# Altium project UZ_CarrierBoard.PrjPcb (part 7 of 10)

## Sheet Power_Supply_TPS54260.SchDoc
size A4; Author: AG / EA / MG; CompanyName: Technische Hochschule Nürnberg Georg Simon Ohm; Organization: UltraZohm; Address1: Kesslerplatz 12; Address2: 90489 Nürnberg; Address3: GERMANY; SheetNumber: 23; SheetTotal: 40; Website: www.ultrazohm.com
Used 4 times, as channels U_User_Connectors/12V_FAN, U_Power_Supply_2/1V8_PER, U_Power_Supply_2/1V8_MOD, U_S3C_SupplyAndMonitoring/3V3_S3C. Parts and nets are listed once, with the designators drawn on the sheet.
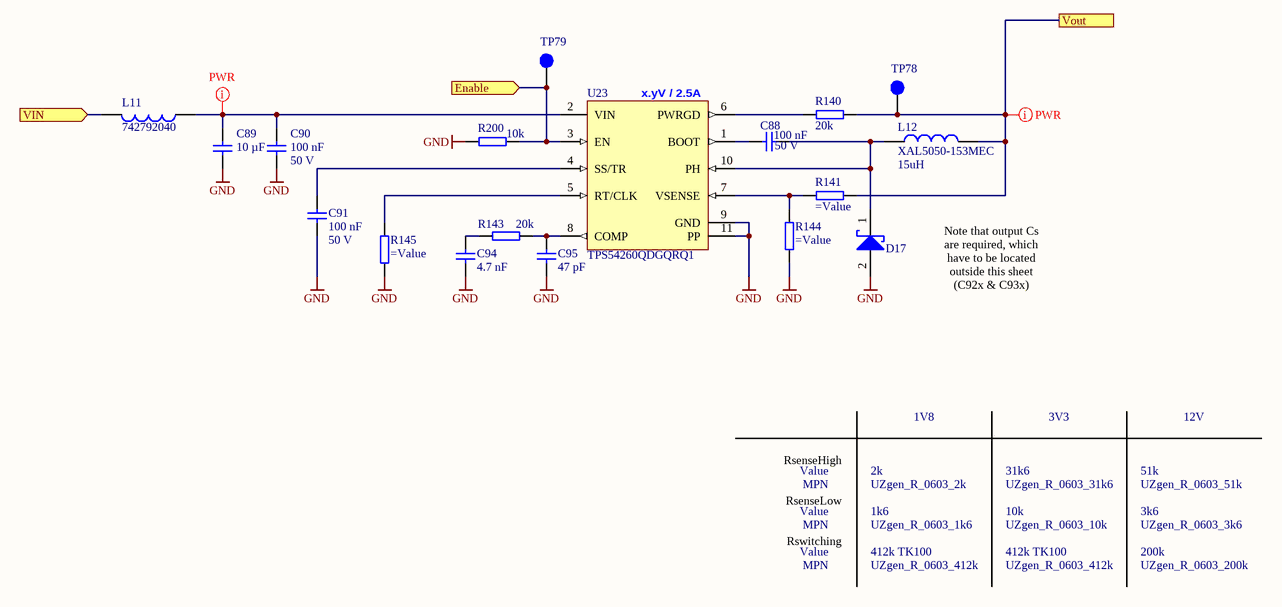
[diagram p23: Power_Supply_TPS54260.SchDoc]

### Parts
C88  100 nF  Voltage: 50 V  [C_0603_TE]
C89  10 µF  [C_1206_TE]
C90  100 nF  Voltage: 50 V  [C_0603_TE]
C91  100 nF  Voltage: 50 V  [C_0603_TE]
C94  4.7 nF  [C_0603_TE]
C95  47 pF  [C_0603_TE]
D17  STPS340UY  [SMB]  (value not drawn)
L11  742792040  [WE-CBF_0805_High Current]
L12  XAL5050-153MEC  value 15uH  [XAL5050153MEC]
R140  20k  [R_0603_TE]
R141  (no value)  [R_0603_TE]
R143  20k  [R_0603_TE]
R144  (no value)  [R_0603_TE]
R145  (no value)  [R_0603_TE]
R200  10k  [R_0603_TE]
TP78  Testpoint 1mm  [TP_1mm]  (value not drawn)  (no BOM)
TP79  Testpoint 1mm  [TP_1mm]  (value not drawn)  (no BOM)
U23  TPS54260QDGQRQ1  [TSOP-10_DGQ0010D_N]

### Ports
Enable (in), VIN (in), Vout

### Nets
GND: C89.2 C90.1 C91.1 C94.2 C95.2 D17.2(A) R144.2 R145.2 R200.1 U23.9(GND) U23.11(PP)
Enable: R200.2 TP79.1 U23.3(EN) ; port Enable
VIN: L11.2 ; port VIN
Vout: L12.2 R140.1 R141.1 TP78.1 ; port Vout
NetC88_1: C88.1 D17.1(K) L12.1 U23.10(PH)
NetC88_2: C88.2 U23.1(BOOT)
NetC89_1: C89.1 C90.2 L11.1 U23.2(VIN)
NetC91_2: C91.2 U23.4(SS/TR)
NetC94_1: C94.1 R143.2
NetC95_1: C95.1 R143.1 U23.8(COMP)
NetR140_2: R140.2 U23.6(PWRGD)
NetR141_2: R141.2 R144.1 U23.7(VSENSE)
NetR145_1: R145.1 U23.5(RT/CLK)

### Channels
U_User_Connectors/12V_FAN: designators end in A; ports Enable=Enable VIN=VIN Vout=12V_FAN
U_Power_Supply_2/1V8_PER: designators end in B; ports Enable=Enable VIN=VIN Vout=1V8out_PER
U_Power_Supply_2/1V8_MOD: designators end in C; ports Enable=Enable VIN=VIN Vout=1V8out_MOD
U_S3C_SupplyAndMonitoring/3V3_S3C: designators end in D; ports Enable=Enable VIN=VIN4 Vout=3V3_S3C

### Layout directives
net class PWR: 12V_FAN, NetC89A_1

### Notes on the sheet
- (near U23) x.yV / 2.5A
- Note that output Cs are required, which have to be located outside this sheet (C92x & C93x)
- RsenseHigh (@{"Id":"WRUMMABL\CGJYPHNX","ObjectType":2})
- 1V8
- 3V3
- 12V
- RsenseLow (@{"Id":"WRUMMABL\LDWXELDL","ObjectType":2})
- Value
- MPN
- 2k
- UZgen_R_0603_2k
- 1k6
- UZgen_R_0603_1k6
- 31k6
- UZgen_R_0603_31k6
- 10k
- UZgen_R_0603_10k
- 51k
- 3k6
- UZgen_R_0603_3k6
- UZgen_R_0603_51k
- Rswitching (@{"Id":"WRUMMABL\GZIHHFRB","ObjectType":2})
- 412k TK100
- UZgen_R_0603_412k
- 200k
- UZgen_R_0603_200k
- Title
- Revision:
- Design Engineer:
- Date:
- Project:
- Sheet
- of

### Library data of the parts
C88 C90 C91 = UZgen_C_0603_100nF_50V_X7R: Generic capacitor; Manufacturer: UZgen; Tolerance: 10 %; Created from: AGeiger; Value: 100 nF; Technology: X7R; Manufacturer Part Number: UZgen_C_0603_100nF_50V_X7R; PartID: 1; Created On: 02/07/2024 14:42:23; Device Package: 0603; Mounting Type: SMD; Last Updated: 02/08/2024 14:45:57
C89 = CL31B106KBHNNNE: 50V 10uF X7R ±10% 1206  Multilayer Ceramic Capacitors MLCC - SMD/SMT ROHS; Manufacturer: Samsung Electro-Mechanics; Voltage Rating: 50 VDC; Created from: AGeiger; Value: 10 µF; Tolerance: 10 %; Manufacturer Part Number: CL31B106KBHNNNE; PartID: 107; Created On: 20/09/2022 20:14:50; ComponentLink1Description: Datasheet; ComponentLink1URL: https://datasheet.lcsc.com/lcsc/1810221111_Samsung-Electro-Mechanics-CL31B106KBHNNNE_C89632.pdf; Component Type: Capacitor 1206; Device Package: 1206; Last Updated: 02/08/2024 15:35:49; Mounting Type: SMD; Operating Temperature: -55 - 125°C; Series: X7R; Supplier 1: LCSC; Supplier Part Number 1: C89632; Type: Capacitor; Live Cycle Status: 1; LCSC Part Number: C89632
C94 = GRM1885C1H472JA01D: 50V 4.7nF C0G ±5% 0603 Multilayer Ceramic Capacitors MLCC; Manufacturer: Murata Electronics; Created from: MGeier; Tolerance: 5%; Value: 4.7 nF; Manufacturer Part Number: GRM1885C1H472JA01D; PartID: 153; Created On: 02/08/2024 16:00:00; ComponentLink1Description: Datasheet; ComponentLink1URL: https://wmsc.lcsc.com/wmsc/upload/file/pdf/v2/lcsc/2304140030_Murata-Electronics-GRM1885C1H472JA01D_C85980.pdf; Component Type: Capacitor 0603; Device Package: 0603; Last Updated: 02/08/2024 16:00:00; Mounting Type: SMD; Operating Temperature: –55 to 125°C; Series: GRM (Chip Multilayer Ceramic Capacitors for General Purpose); Supplier 1: LCSC; Supplier Part Number 1: C85980; Type: Capacitor; Voltage Rating: 50 V; Live Cycle Status: 1; LCSC Part Number: C85980; Stock number: not stored
C95 = CL10C470JB8NNNC: 50V 47pF C0G ±5% 0603 Multilayer Ceramic Capacitors MLCC; Manufacturer: Samsung Electro-Mechanics; Created from: MGeier; Tolerance: 5%; Value: 47 pF; Manufacturer Part Number: CL10C470JB8NNNC; PartID: 154; Created On: 02/08/2024 16:00:00; ComponentLink1Description: Datasheet; ComponentLink1URL: https://wmsc.lcsc.com/wmsc/upload/file/pdf/v2/lcsc/2304140030_Samsung-Electro-Mechanics-CL10C470JB8NNNC_C1671.pdf; Component Type: Capacitor 0603; Device Package: 0603; Last Updated: 02/08/2024 16:00:00; Mounting Type: SMD; Operating Temperature: –55 to 125°C; Series: CL; Supplier 1: LCSC; Supplier Part Number 1: C1671; Type: Capacitor; Voltage Rating: 50 V; Live Cycle Status: 1; LCSC Part Number: C1671; Stock number: not stored
D17 = STPS340UY: Power Schottky Rectifier, 3 A, 40 V, 0.57 µF; Manufacturer: STMicroelectronics; Forward Current: 3 A; Forward Voltage: 0.84 V; Reverse Current: 10 mA; Created from: MGremer; Manufacturer Part Number: STPS340UY; PartID: 1; Created On: 06/01/2021 14:34:10; ComponentLink1Description: Datasheet; ComponentLink1URL: https://www.mouser.de/datasheet/2/389/stps340_y-1851750.pdf; Component Type: Power Schottky Rectifier; Device Package: SMB; Last Updated: 04/09/2024 15:38:15; Mounting Type: SMD; Operating Temperature: -40 to +150 °C; Series: STPS340-Y; Supplier 1: Mouser; Supplier Part Number 1: 511-STPS340UY; Type: Power Schottky Rectifier; Value: -; Live Cycle Status: 1; Stock number: not stored; Supplier 2: LCSC; Supplier Part Number 2: C283520; LCSC Part Number: C283520
L11 = 742792040: Inductance, 0805, 100 MHz, 600 Ohm, 2 A; Manufacturer: Wuerth Elektronik; Type: Inductance SMD; DC current: 2 A; Value: 600 Ohm; Created from: AGeiger; Manufacturer Part Number: 742792040; PartID: 1; Created On: 18/01/2021 14:53:17; ComponentLink1Description: Datasheet; ComponentLink1URL: https://www.mouser.de/datasheet/2/445/742792040-1720361.pdf; Component Type: Inductance; Device Package: 0805; Last Updated: 22/08/2024 07:43:45; Mounting Type: SMD; Operating Temperature: -55 - 125 °C; Series: WE-CBF; Supplier 1: Mouser; Supplier Part Number 1: 710-742792040; Live Cycle Status: 1; LCSC Part Number: C2661857; Stock number: not stored
L12 = XAL5050-153MEC: 15uH@1MHz  ±20%, 3.9A, 76.7mOhm; Manufacturer: Coilcraft; MF: EPCOS / TDK; DCR: 320m; Rated Current: 0.85 A; Type: Inductance SMD; Created from: FRosner; MPN: B82464G4154M; Supplier 1: Mouser; Supplier Part Number 1: 994-XAL5050-153MEC; Manufacturer Part Number: XAL5050-153MEC; PartID: 24; Created On: 05/09/2024 12:44:32; ComponentLink1Description: Datasheet; ComponentLink1URL: https://www.mouser.de/datasheet/2/597/xal50xx-270657.pdf; Component Type: SMD Power Inductor; Device Package: 5.28 x5.1x5.48mm; Last Updated: 05/09/2024 12:44:32; Mounting Type: SMD; Operating Temperature: -40°C to +125°C; Series: XAL5050; Supplier 2: LCSC; Supplier Part Number 2: C5291298; DC current: 3.9 A; Live Cycle Status: 1; LCSC Part Number: C5291298; Stock number: not stored
R140 R143 = UZgen_R_0603_20k: Generic resistor; Manufacturer: UZgen; Tolerance: 1 %; Created from: UZgenTool; Value: 20k; Manufacturer Part Number: UZgen_R_0603_20k; PartID: 251; Created On: 02.07.2024 17:29:50; Device Package: 0603; Mounting Type: SMD; Last Updated: 02.07.2024 17:29:50
R141 R144 R145 = UZgen_R_0603_ParaR: Generic resistor (parametric); Manufacturer: UZgen; Tolerance: 1 %; Created from: UZgenTool; PartID: 588; Created On: 08/07/2024 14:34:30; Device Package: 0603; Mounting Type: SMD; Last Updated: 08/07/2024 14:34:30
  R141: Value: =RsenseHigh_Value; Manufacturer Part Number: =RsenseHigh_MPN
  R144: Value: =RsenseLow_Value; Manufacturer Part Number: =RsenseLow_MPN
  R145: Manufacturer Part Number: =Rswitching_MPN; Value: =Rswitching_Value
R200 = UZgen_R_0603_10k: Generic resistor; Manufacturer: UZgen; Tolerance: 1 %; Created from: AGeiger; Value: 10k; Manufacturer Part Number: UZgen_R_0603_10k; PartID: 1; Created On: 02.07.2024 14:34:53; Device Package: 0603; Mounting Type: SMD; Last Updated: 02.07.2024 14:37:16
TP78 TP79 = NULL: Manufacturer Part Number: NULL; Created from: AGeiger; Created: 2018_06_25_AGeiger; Value: Testpoint 1mm; PartID: 9; Created On: 20/09/2022 13:14:57; Component Type: Testpoint; Last Updated: 20/09/2022 13:15:39; Manufacturer: NULL; Supplier 1: NULL; Supplier Part Number 1: NULL; Type: Testpoint; Live Cycle Status: 1
U23 = TPS54260QDGQRQ1: High Efficiency Step-Down Converter, MSOP Package, 2.5 A, 3.5 - 60 V input, adjustable output; Manufacturer: Texas Instruments; Created from: MGremer; Value: 2.5 A; Manufacturer Part Number: TPS54260QDGQRQ1; PartID: 4; Created On: 06/01/2021 09:48:37; ComponentLink1Description: Datasheet; ComponentLink1URL: https://www.ti.com/general/docs/suppproductinfo.tsp?distId=26&gotoUrl=http%3A%2F%2Fwww.ti.com%2Flit%2Fgpn%2Ftps54260-q1; Component Type: Step-Down Converter; Last Updated: 12/09/2024 22:45:16; Mounting Type: SMD; Supplier 1: Mouser; Supplier Part Number 1: 595-TPS54260QDGQRQ1; Type: Step-Down Converter; Live Cycle Status: 1; LCSC Part Number: C181278; Stock number: not stored; Device Package: MSOP; Series: TPS54260-Q1

## Sheet Power_Supply_1.SchDoc
size A4; Author: AG / EA / MG; CompanyName: Technische Hochschule Nürnberg Georg Simon Ohm; Organization: UltraZohm; Address1: Kesslerplatz 12; Address2: 90489 Nürnberg; Address3: GERMANY; SheetNumber: 27; Website: www.ultrazohm.com
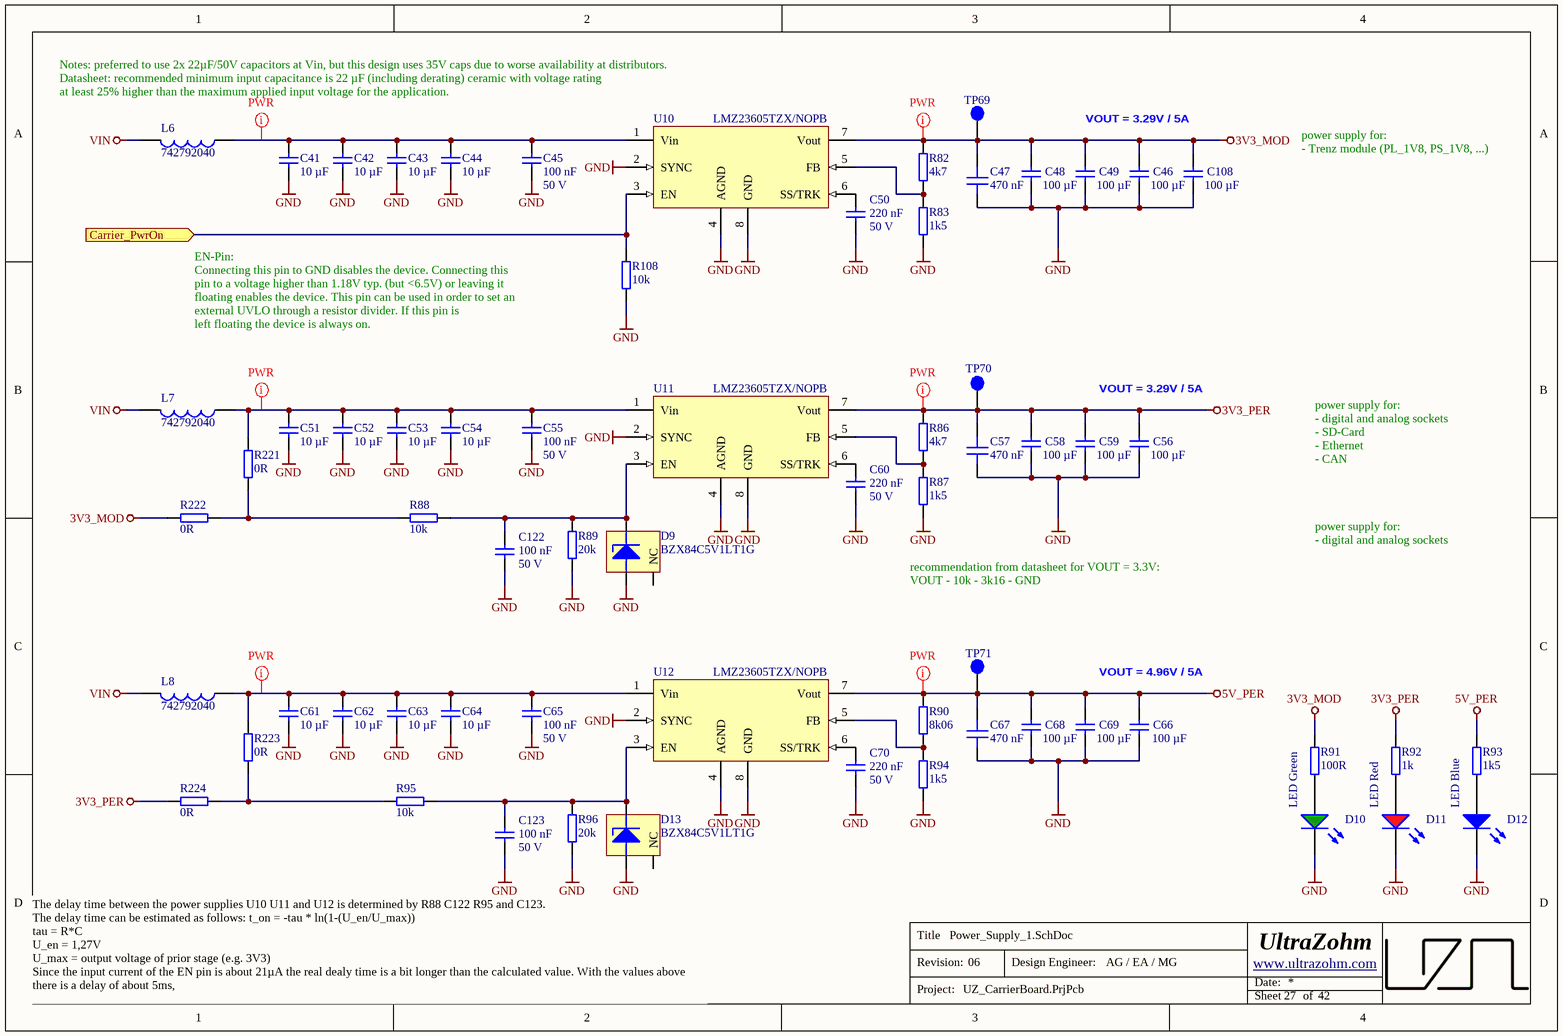
[diagram p24: Power_Supply_1.SchDoc]

### Parts
C41  10 µF  [C_1206_TE]
C42  10 µF  [C_1206_TE]
C43  10 µF  [C_1206_TE]
C44  10 µF  [C_1206_TE]
C45  100 nF  Voltage: 50 V  [C_0603_TE]
C46  100 µF  [C_1206_TE]
C47  470 nF  [C_0603_TE]
C48  100 µF  [C_1206_TE]
C49  100 µF  [C_1206_TE]
C50  220 nF  Voltage: 50 V  [C_0603_TE]
C51  10 µF  [C_1206_TE]
C52  10 µF  [C_1206_TE]
C53  10 µF  [C_1206_TE]
C54  10 µF  [C_1206_TE]
C55  100 nF  Voltage: 50 V  [C_0603_TE]
C56  100 µF  [C_1206_TE]
C57  470 nF  [C_0603_TE]
C58  100 µF  [C_1206_TE]
C59  100 µF  [C_1206_TE]
C60  220 nF  Voltage: 50 V  [C_0603_TE]
C61  10 µF  [C_1206_TE]
C62  10 µF  [C_1206_TE]
C63  10 µF  [C_1206_TE]
C64  10 µF  [C_1206_TE]
C65  100 nF  Voltage: 50 V  [C_0603_TE]
C66  100 µF  [C_1206_TE]
C67  470 nF  [C_0603_TE]
C68  100 µF  [C_1206_TE]
C69  100 µF  [C_1206_TE]
C70  220 nF  Voltage: 50 V  [C_0603_TE]
C108  100 µF  [C_1206_TE]
C122  100 nF  Voltage: 50 V  [C_0603_TE]
C123  100 nF  Voltage: 50 V  [C_0603_TE]
D9  BZX84C5V1LT1G  [SOT95P237X112-3N]
D10  LED Green  [WL-SMCW_0603]
D11  LED Red  [WL-SMCW_0603]
D12  LED Blue  [WL-SMCW_0603]
D13  BZX84C5V1LT1G  [SOT95P237X112-3N]
L6  742792040  [WE-CBF_0805_High Current]
L7  742792040  [WE-CBF_0805_High Current]
L8  742792040  [WE-CBF_0805_High Current]
R82  4k7  [R_0603_TE]
R83  1k5  [R_0603_TE]
R86  4k7  [R_0603_TE]
R87  1k5  [R_0603_TE]
R88  10k  [R_0603_TE]
R89  20k  [R_0603_TE]
R90  8k06  [R_0402_TE]
R91  100R  [R_0603_TE]
R92  1k  [R_0603_TE]
R93  1k5  [R_0603_TE]
R94  1k5  [R_0603_TE]
R95  10k  [R_0603_TE]
R96  20k  [R_0603_TE]
R108  10k  [R_0603_TE]
R221  0R  [R_1206_TE]
R222  0R  [R_1206_TE]
R223  0R  [R_1206_TE]
R224  0R  [R_1206_TE]
TP69  Testpoint 1mm  [TP_1mm]  (value not drawn)  (no BOM)
TP70  Testpoint 1mm  [TP_1mm]  (value not drawn)  (no BOM)
TP71  Testpoint 1mm  [TP_1mm]  (value not drawn)  (no BOM)
U10  LMZ23605TZX/NOPB  [7TO-PMOD]
U11  LMZ23605TZX/NOPB  [7TO-PMOD]
U12  LMZ23605TZX/NOPB  [7TO-PMOD]

### Ports
Carrier_PwrOn (in)

### Nets
3V3_MOD: C46.1 C47.1 C48.1 C49.1 C108.1 R82.2 R91.2 R222.2 TP69.1 U10.7(Vout)
3V3_PER: C56.1 C57.1 C58.1 C59.1 R86.2 R92.2 R224.2 TP70.1 U11.7(Vout)
5V_PER: C66.1 C67.1 C68.1 C69.1 R90.1 R93.2 TP71.1 U12.7(Vout)
GND: C41.2 C42.2 C43.2 C44.2 C45.1 C46.2 C47.2 C48.2 C49.2 C50.2 C51.2 C52.2 C53.2 C54.2 C55.1 C56.2 C57.2 C58.2 C59.2 C60.2 C61.2 C62.2 C63.2 C64.2 C65.1 C66.2 C67.2 C68.2 C69.2 C70.2 C108.2 C122.2 C123.2 D9.1(ANODE) D10.1(K) D11.1(K) D12.1(K) D13.1(ANODE) R83.1 R87.1 R89.1 R94.2 R96.1 R108.1 U10.2(SYNC) U10.4(AGND) U10.8(GND) U11.2(SYNC) U11.4(AGND) U11.8(GND) U12.2(SYNC) U12.4(AGND) U12.8(GND)
VIN: L6.2 L7.2 L8.2
Carrier_PwrOn: R108.2 U10.3(EN) ; port Carrier_PwrOn
NetC41_1: C41.1 C42.1 C43.1 C44.1 C45.2 L6.1 U10.1(Vin)
NetC50_1: C50.1 U10.6(SS/TRK)
NetC51_1: C51.1 C52.1 C53.1 C54.1 C55.2 L7.1 R221.2 U11.1(Vin)
NetC60_1: C60.1 U11.6(SS/TRK)
NetC61_1: C61.1 C62.1 C63.1 C64.1 C65.2 L8.1 R223.2 U12.1(Vin)
NetC70_1: C70.1 U12.6(SS/TRK)
NetC122_1: C122.1 D9.3(KATHODE) R88.2 R89.2 U11.3(EN)
NetC123_1: C123.1 D13.3(KATHODE) R95.2 R96.2 U12.3(EN)
NetD10_2: D10.2(A) R91.1
NetD11_2: D11.2(A) R92.1
NetD12_2: D12.2(A) R93.1
NetR82_1: R82.1 R83.2 U10.5(FB)
NetR86_1: R86.1 R87.2 U11.5(FB)
NetR88_1: R88.1 R221.1 R222.1
NetR90_2: R90.2 R94.1 U12.5(FB)
NetR95_1: R95.1 R223.1 R224.1

Not connected (* = marked no-connect by the designer): D9 2(NC); D13 2(NC)

### Layout directives
net class PWR: 3V3_MOD, 3V3_PER, 5V_PER, NetC41_1, NetC51_1, NetC61_1

### Notes on the sheet
- Notes: preferred to use 2x 22µF/50V capacitors at Vin, but this design uses 35V caps due to worse availability at distributors.
- Datasheet: recommended minimum input capacitance is 22 µF (including derating) ceramic with voltage rating
- at least 25% higher than the maximum applied input voltage for the application.
- VOUT = 3.29V / 5A
- power supply for:
  - Trenz module (PL_1V8, PS_1V8, ...)
- EN-Pin:
  Connecting this pin to GND disables the device. Connecting this pin to a voltage higher than 1.18V typ. (but <6.5V) or leaving it floating enables the device. This pin can be used in order to set an external UVLO through a resistor divider. If this pin is
  left floating the device is always on.
- power supply for:
  - digital and analog sockets
  - SD-Card
  - Ethernet
  - CAN
- power supply for:
  - digital and analog sockets
- recommendation from datasheet for VOUT = 3.3V:
  VOUT - 10k - 3k16 - GND
- VOUT = 4.96V / 5A
- The delay time between the power supplies U10 U11 and U12 is determined by R88 C122 R95 and C123.
  The delay time can be estimated as follows: t_on = -tau * ln(1-(U_en/U_max))
  tau = R*C
  U_en = 1,27V
  U_max = output voltage of prior stage (e.g. 3V3)
  Since the input current of the EN pin is about 21µA the real dealy time is a bit longer than the calculated value. With the values above there is a delay of about 5ms,
- Title
- Revision:
- Design Engineer:
- Date:
- Project:
- Sheet
- of

### Library data of the parts
C41-C44 C51-C54 C61-C64 = UZgen_C_1206_10uF_50V_X7R: Generic capacitor; Manufacturer: UZgen; Tolerance: 10 %; Created from: MGeier; Voltage: 50V; Value: 10 µF; Manufacturer Part Number: UZgen_C_1206_10uF_50V_X7R; PartID: 5807; Created On: 20/03/2025 14:05:00; Device Package: 1206; Last Updated: 20/03/2025 14:05:00; Mounting Type: SMD; Technology: X7R
C45 C55 C65 C122 C123 = UZgen_C_0603_100nF_50V_X7R: as C88 on sheet Power_Supply_TPS54260; Value: 100 nF; Technology: X7R; Manufacturer Part Number: UZgen_C_0603_100nF_50V_X7R; PartID: 1; Created On: 02/07/2024 14:42:23; Device Package: 0603; Mounting Type: SMD; Last Updated: 02/08/2024 14:45:57
C46 C48 C49 C56 C58 C59 C66 C68 C69 C108 = CL31A107MQHNNNE: 6.3V 100uF X5R ±20% 1206 Multilayer Ceramic Capacitors MLCC; Manufacturer: Samsung Electro-Mechanics; Created from: MGeier; Tolerance: 20%; Value: 100 µF; Manufacturer Part Number: CL31A107MQHNNNE; PartID: 152; Created On: 02/08/2024 16:00:00; ComponentLink1Description: Datasheet; ComponentLink1URL: https://wmsc.lcsc.com/wmsc/upload/file/pdf/v2/lcsc/2304140030_Samsung-Electro-Mechanics-CL31A107MQHNNNE_C15008.pdf; Component Type: Capacitor 1206; Device Package: 1206; Last Updated: 02/08/2024 16:00:00; Mounting Type: SMD; Operating Temperature: -55 - 85°C; Series: CL; Supplier 1: LCSC; Supplier Part Number 1: C15008; Type: Capacitor; Voltage Rating: 6.3 V; Live Cycle Status: 1; LCSC Part Number: C15008; Stock number: not stored
C47 C57 C67 = CL10A474KB8NNNC: Capacitor 0603, 50 VDC, 470 nF, X5R; Manufacturer: Samsung Electro-Mechanics; Tolerance: 10 %; Created from: AGeiger; Voltage Rating: 50 VDC; Value: 470 nF; Manufacturer Part Number: CL10A474KB8NNNC; PartID: 103; Created On: 22/08/2022 14:44:45; Device Package: 0603; Mounting Type: SMD; Last Updated: 22/04/2025 15:48:45; ComponentLink1Description: Datasheet; ComponentLink1URL: https://datasheet.lcsc.com/lcsc/1810191213_Samsung-Electro-Mechanics-CL10A474KB8NNNC_C170149.pdf; Component Type: Capacitor 0603; Operating Temperature: -55 - 85°C; Series: X5R; Supplier 1: LCSC; Supplier Part Number 1: C170149; Supplier 2: Mouser; Supplier Part Number 2: 187-CL10A474KB8NNNC; Type: Capacitor; Live Cycle Status: 1; LCSC Part Number: C170149
C50 C60 C70 = UZgen_C_0603_220nF_50V_X7R: Generic capacitor; Manufacturer: UZgen; Tolerance: 10 %; Created from: UZgenTool; Value: 220 nF; Technology: X7R; Manufacturer Part Number: UZgen_C_0603_220nF_50V_X7R; PartID: 2; Created On: 02/07/2024 14:42:23; Device Package: 0603; Mounting Type: SMD; Last Updated: 02/08/2024 14:45:57
D9 D13 = 30827: Zener Diode 5.1V 6% 225mW; AN: 30827; Mixed: SMT; Temperature-Range: -65/+150 (Tj Abs); Case: SOT23-3; Voltage: 5.1V; HelpURL: b:\AD\adlib\datasheet\ON_Semiconductor\BZX84CxxxLT1G\; H-ART: BZX84C5V1LT1G; Storage-Temperature: -65/+150 (Tj Abs)
D10 = UZgen_LED_0603_Green: Standard LEDs - SMD 0603 green; Manufacturer: UZgen; Created from: UZgenTool; Manufacturer Part Number: UZgen_LED_0603_Green; PartID: 21; Created On: 09/09/2024 10:45:01; ComponentLink1Description: N/A; ComponentLink1URL: N/A; Component Type: LED Diode; Device Package: 0603; Last Updated: 09/09/2024 10:45:01; Mounting Type: SMD; Supplier 1: LCSC; Supplier Part Number 1: =LCSC Part Number; Type: Standard; Live Cycle Status: 1; Stock number: not stored; Color: green; Value: LED Green
D11 = UZgen_LED_0603_Red: Standard LEDs - SMD 0603 red; Manufacturer: UZgen; Created from: UZgenTool; Manufacturer Part Number: UZgen_LED_0603_Red; PartID: 22; Created On: 09/09/2024 10:45:01; ComponentLink1Description: N/A; ComponentLink1URL: N/A; Component Type: LED Diode; Device Package: 0603; Last Updated: 09/09/2024 10:45:01; Mounting Type: SMD; Supplier 1: LCSC; Supplier Part Number 1: =LCSC Part Number; Type: Standard; Live Cycle Status: 1; Stock number: not stored; Color: red; Value: LED Red
D12 = UZgen_LED_0603_Blue: Standard LEDs - SMD 0603 blue; Manufacturer: UZgen; Created from: UZgenTool; Manufacturer Part Number: UZgen_LED_0603_Blue; PartID: 20; Created On: 09/09/2024 10:45:01; ComponentLink1Description: N/A; ComponentLink1URL: N/A; Component Type: LED Diode; Device Package: 0603; Last Updated: 09/09/2024 10:45:01; Mounting Type: SMD; Supplier 1: LCSC; Supplier Part Number 1: =LCSC Part Number; Type: Standard; Live Cycle Status: 1; Stock number: not stored; Color: blue; Value: LED Blue
L6-L8 = 742792040: as L11 on sheet Power_Supply_TPS54260; Manufacturer Part Number: 742792040; PartID: 1; Created On: 18/01/2021 14:53:17; ComponentLink1Description: Datasheet; ComponentLink1URL: https://www.mouser.de/datasheet/2/445/742792040-1720361.pdf; Component Type: Inductance; Device Package: 0805; Last Updated: 22/08/2024 07:43:45; Mounting Type: SMD; Operating Temperature: -55 - 125 °C; Series: WE-CBF; Supplier 1: Mouser; Supplier Part Number 1: 710-742792040; Live Cycle Status: 1; LCSC Part Number: C2661857; Stock number: not stored
R82 R86 = UZgen_R_0603_4k7: Generic resistor; Manufacturer: UZgen; Tolerance: 1 %; Created from: UZgenTool; Value: 4k7; Manufacturer Part Number: UZgen_R_0603_4k7; PartID: 237; Created On: 02.07.2024 17:29:50; Device Package: 0603; Mounting Type: SMD; Last Updated: 02.07.2024 17:29:50
R83 R87 R93 R94 = UZgen_R_0603_1k5: Generic resistor; Manufacturer: UZgen; Tolerance: 1 %; Created from: UZgenTool; Value: 1k5; Manufacturer Part Number: UZgen_R_0603_1k5; PartID: 225; Created On: 02.07.2024 17:29:49; Device Package: 0603; Mounting Type: SMD; Last Updated: 02.07.2024 17:29:49
R88 R95 R108 = UZgen_R_0603_10k: as R200 on sheet Power_Supply_TPS54260; Value: 10k; Manufacturer Part Number: UZgen_R_0603_10k; PartID: 1; Created On: 02/07/2024 14:34:53; Device Package: 0603; Mounting Type: SMD; Last Updated: 02/07/2024 14:37:16
R89 R96 = UZgen_R_0603_20k: as R140 on sheet Power_Supply_TPS54260; Value: 20k; Manufacturer Part Number: UZgen_R_0603_20k; PartID: 251; Created On: 02.07.2024 17:29:50; Device Package: 0603; Mounting Type: SMD; Last Updated: 02.07.2024 17:29:50
R90 = UZgen_R_0402_8k06: Non generic resistor; Manufacturer: UZgen; Tolerance: 1 %; Created from: UZgenTool; Value: 8k06; Manufacturer Part Number: UZgen_R_0402_8k06; PartID: 584; Created On: 08.07.2024 14:34:30; Device Package: 0402; Mounting Type: SMD; Last Updated: 08.07.2024 14:34:30
R91 = UZgen_R_0603_100R: Generic resistor; Manufacturer: UZgen; Tolerance: 1 %; Created from: UZgenTool; Value: 100R; Manufacturer Part Number: UZgen_R_0603_100R; PartID: 197; Created On: 02.07.2024 17:29:48; Device Package: 0603; Mounting Type: SMD; Last Updated: 02.07.2024 17:29:48
R92 = UZgen_R_0603_1k: Generic resistor; Manufacturer: UZgen; Tolerance: 1 %; Created from: UZgenTool; Value: 1k; Manufacturer Part Number: UZgen_R_0603_1k; PartID: 221; Created On: 02.07.2024 17:29:49; Device Package: 0603; Mounting Type: SMD; Last Updated: 02.07.2024 17:29:49
R221-R224 = UZgen_R_1206_0R: Generic resistor; Manufacturer: UZgen; Tolerance: 1 %; Created from: UZgenTool; Value: 0R; Manufacturer Part Number: UZgen_R_1206_0R; PartID: 583; Created On: 08/07/2024 14:34:30; Device Package: 1206; Mounting Type: SMD; Last Updated: 08/07/2024 14:34:30
TP69-TP71 = 25063: AN: 25063; Mixed: SMT
U10-U12 = LMZ23605TZX/NOPB: Switching Voltage Regulators Gen2 36Vin 5A Module; Manufacturer: Texas Instruments; Created from: FRosner; Manufacturer Part Number: LMZ23605TZX/NOPB; PartID: 8; Created On: 28/06/2024 11:02:49; ComponentLink1Description: Datasheet; ComponentLink1URL: https://www.ti.com/lit/ds/symlink/lmz23605.pdf; Component Type: DC-DC Converters ROHS; Device Package: TO-PMOD-7; Last Updated: 06/08/2024 16:10:42; Mounting Type: SMD; Operating Temperature: -40 - 85 °C; Supplier 1: LCSC; Supplier Part Number 1: C913851; Type: Switching Voltage Regulators; Live Cycle Status: 1; LCSC Part Number: C913851; Stock number: not stored

## Sheet Power_Supply_2.SchDoc
size A4; Author: AG / EA / MG; CompanyName: Technische Hochschule Nürnberg Georg Simon Ohm; Organization: UltraZohm; Address1: Kesslerplatz 12; Address2: 90489 Nürnberg; Address3: GERMANY; SheetNumber: 28; Website: www.ultrazohm.com
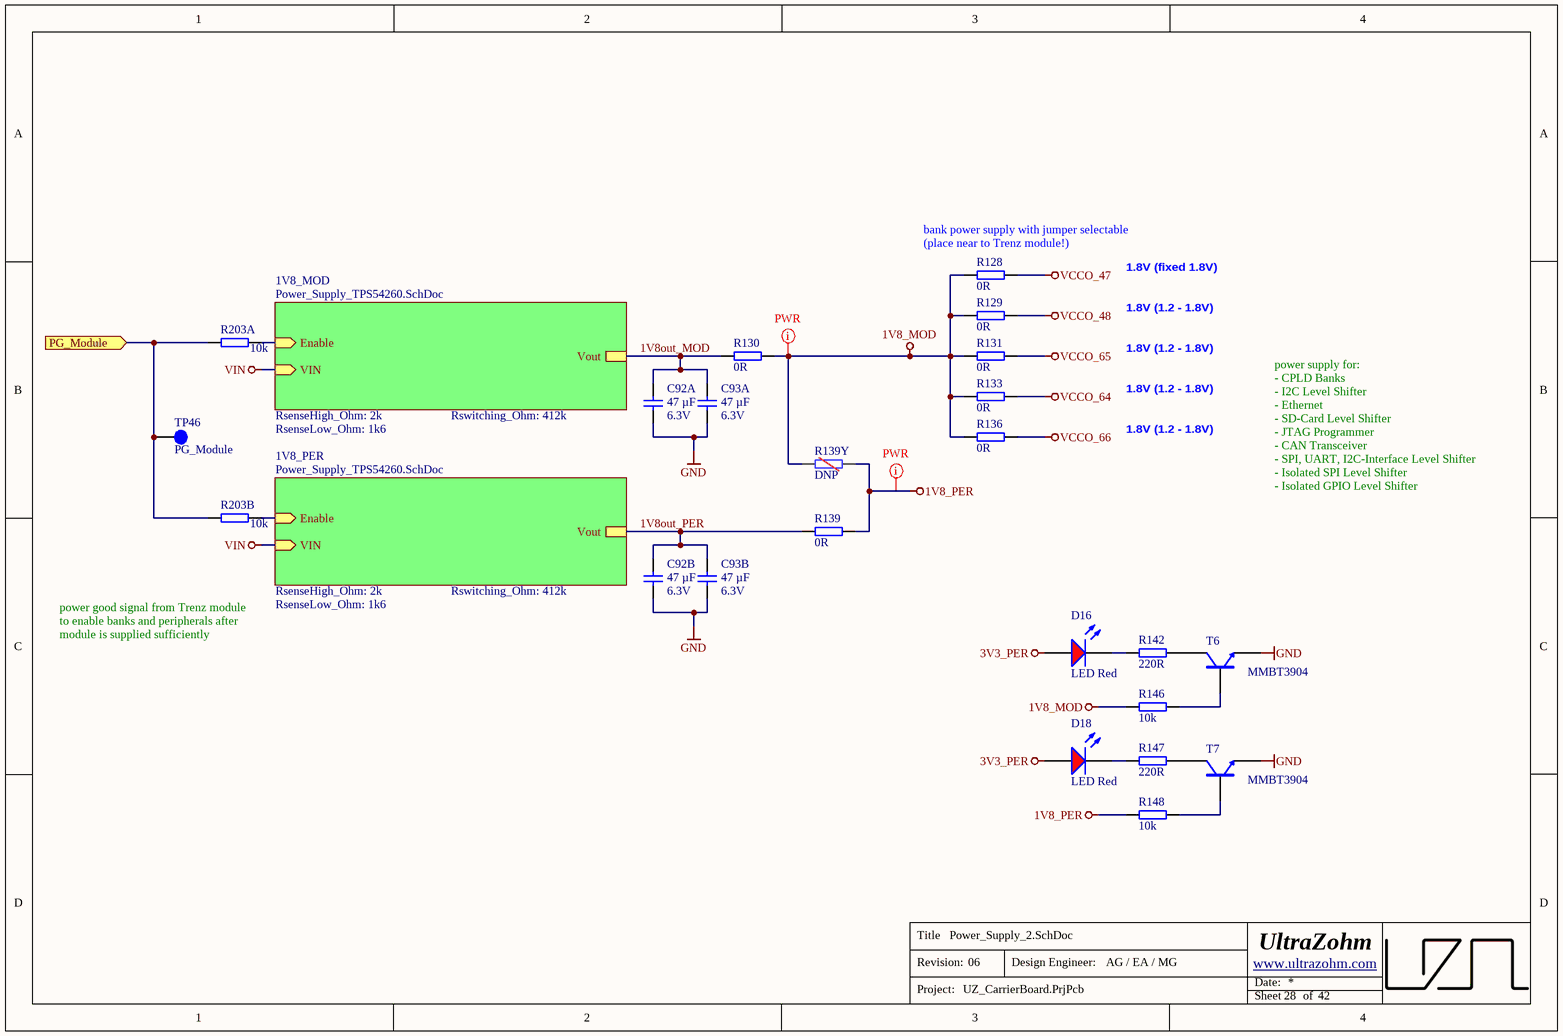
[diagram p25: Power_Supply_2.SchDoc]

### Parts
C92A  47 µF  Voltage: 6.3V  [C_0805_TE]
C92B  47 µF  Voltage: 6.3V  [C_0805_TE]
C93A  47 µF  Voltage: 6.3V  [C_0805_TE]
C93B  47 µF  Voltage: 6.3V  [C_0805_TE]
D16  LED Red  [WL-SMCW_0603]
D18  LED Red  [WL-SMCW_0603]
R128  0R  [R_1206_TE]
R129  0R  [R_1206_TE]
R130  0R  [R_1206_TE]
R131  0R  [R_1206_TE]
R133  0R  [R_1206_TE]
R136  0R  [R_1206_TE]
R139  0R  [R_1206_TE]
R139Y  DNP  [R_1206_TE-DNP]  (no BOM)
R142  220R  [R_0603_TE]
R146  10k  [R_0603_TE]
R147  220R  [R_0603_TE]
R148  10k  [R_0603_TE]
R203A  10k  [R_0603_TE]
R203B  10k  [R_0603_TE]
T6  MMBT3904  [SOT95P280X145-3N]
T7  MMBT3904  [SOT95P280X145-3N]
TP46  PG_Module  [TP_1mm]  (no BOM)

### Sub-sheets
1V8_MOD = Power_Supply_TPS54260.SchDoc: Vout, Enable (in), VIN (in)  | RsenseHigh_Ohm: 2k; RsenseLow_Ohm: 1k6; Rswitching_Ohm: 412k; SubSheet_SheetNumber: 28.1; Output_V: 1.8
1V8_PER = Power_Supply_TPS54260.SchDoc: Vout, Enable (in), VIN (in)  | RsenseHigh_Ohm: 2k; RsenseLow_Ohm: 1k6; Rswitching_Ohm: 412k; SubSheet_SheetNumber: 28.2; Output_V: 1.8

### Ports
PG_Module (in)

### Nets
1V8_MOD: R128.1 R129.1 R130.2 R131.1 R133.1 R136.1 R139Y.1 R146.1
1V8_PER: R139.2 R139Y.2 R148.1
3V3_PER: D16.2(A) D18.2(A)
GND: C92A.1 C92B.1 C93A.1 C93B.1 T6.2(EMITTER) T7.2(EMITTER)
VCCO_47: R128.2
VCCO_48: R129.2
VCCO_64: R133.2
VCCO_65: R131.2
VCCO_66: R136.2
VIN: sheet 1V8_PER/VIN, sheet 1V8_MOD/VIN
1V8out_MOD: C92A.2 C93A.2 R130.1 ; sheet 1V8_MOD/Vout
1V8out_PER: C92B.2 C93B.2 R139.1 ; sheet 1V8_PER/Vout
Enable: R203A.2 ; sheet 1V8_MOD/Enable
Enable: R203B.2 ; sheet 1V8_PER/Enable  [a separate net that carries the same name]
PG_Module: R203A.1 R203B.1 TP46.1 ; port PG_Module
NetD16_1: D16.1(K) R142.1
NetD18_1: D18.1(K) R147.1
NetR142_2: R142.2 T6.3(COLLECTOR)
NetR146_2: R146.2 T6.1(BASIS)
NetR147_2: R147.2 T7.3(COLLECTOR)
NetR148_2: R148.2 T7.1(BASIS)

### Layout directives
net class PWR: 1V8_MOD, 1V8_PER

### Notes on the sheet
- (near R128) bank power supply with jumper selectable
  (place near to Trenz module!)
- 1.8V (fixed 1.8V)
- 1.8V (1.2 - 1.8V)
- power supply for:
  - CPLD Banks
  - I2C Level Shifter
  - Ethernet
  - SD-Card Level Shifter
  - JTAG Programmer
  - CAN Transceiver
  - SPI, UART, I2C-Interface Level Shifter
  - Isolated SPI Level Shifter
  - Isolated GPIO Level Shifter
- power good signal from Trenz module to enable banks and peripherals after module is supplied sufficiently
- Title
- Revision:
- Design Engineer:
- Date:
- Project:
- Sheet
- of

### Library data of the parts
C92A C92B C93A C93B = UZgen_C_0805_47uF_6.3V_X7R: Generic capacitor; Manufacturer: UZgen; Tolerance: 10 %; Created from: UZgenTool; Value: 47 µF; Technology: X7R; Manufacturer Part Number: UZgen_C_0805_47uF_6.3V_X7R; PartID: 5223; Created On: 02/08/2024 11:18:30; Device Package: 0805; Mounting Type: SMD; Last Updated: 02/08/2024 11:18:30
D16 D18 = UZgen_LED_0603_Red: as D11 on sheet Power_Supply_1; Manufacturer Part Number: UZgen_LED_0603_Red; PartID: 22; Created On: 09/09/2024 10:45:01; ComponentLink1Description: N/A; ComponentLink1URL: N/A; Component Type: LED Diode; Device Package: 0603; Last Updated: 09/09/2024 10:45:01; Mounting Type: SMD; Supplier 1: LCSC; Supplier Part Number 1: =LCSC Part Number; Type: Standard; Live Cycle Status: 1; Stock number: not stored; Color: red; Value: LED Red
R128-R131 R133 R136 R139 = UZgen_R_1206_0R: as R221-R224 on sheet Power_Supply_1; Value: 0R; Manufacturer Part Number: UZgen_R_1206_0R; PartID: 583; Created On: 08.07.2024 14:34:30; Device Package: 1206; Mounting Type: SMD; Last Updated: 08.07.2024 14:34:30
R139Y = UZgen_R_1206_DNP: Generic resistor (DNP); Manufacturer: UZgen; Created from: UZgenTool; Value: DNP; Tolerance: -; Manufacturer Part Number: UZgen_R_1206_DNP; PartID: 595; Created On: 25/03/2025 14:26:15; Device Package: 1206; Mounting Type: SMD; Last Updated: 02/04/2025 19:05:00
R142 R147 = UZgen_R_0603_220R: Generic resistor; Manufacturer: UZgen; Tolerance: 1 %; Created from: UZgenTool; Value: 220R; Manufacturer Part Number: UZgen_R_0603_220R; PartID: 205; Created On: 02.07.2024 17:29:49; Device Package: 0603; Mounting Type: SMD; Last Updated: 02.07.2024 17:29:49
R146 R148 R203A R203B = UZgen_R_0603_10k: as R200 on sheet Power_Supply_TPS54260; Value: 10k; Manufacturer Part Number: UZgen_R_0603_10k; PartID: 1; Created On: 02.07.2024 14:34:53; Device Package: 0603; Mounting Type: SMD; Last Updated: 02.07.2024 14:37:16
T6 T7 = MMBT3904: Bipolartransistor, 40V 200mW 200mA 100@10mA,1V 300MHz 300mV@50mA,5mA NPN +150℃@(Tj) SOT-23(SOT-23-3); Manufacturer: Jiangsu Changjing Electronics Technology Co., Ltd.; Number Of Channels: single; Collector Basis Voltage: 60 V; Created from: NDiringer; Manufacturer Part Number: MMBT3904; PartID: 2; Created On: 10.06.2022 12:04:49; ComponentLink1Description: Datasheet; ComponentLink1URL: https://datasheet.lcsc.com/lcsc/1811011934_Jiangsu-Changjing-Electronics-Technology-Co---Ltd--MMBT3904_C20526.pdf; Component Type: Bipolartransistor; Device Package: SOT-23-3; Last Updated: 10.08.2022 13:48:16; Mounting Type: SMD; Operating Temperature: -55 - 150 °C; Series: MMBT3904; Supplier 1: Mouser; Supplier Part Number 1: MMBT3904; Supplier 2: LCSC/JLCPCB; Supplier Part Number 2: C20526; Type: Bipolartransistor; Collector Emitter Voltage: 40 V; Polarization: NPN; Power Dissipation: 200 mW; Value: 40 V; Live Cycle Status: 1; LCSC Part Number: C20526
TP46 = NULL: Testpoint 1mm; Manufacturer Part Number: NULL; Created from: AGeiger; Created: 2018_06_25_AGeiger; Value: PG_Module; PartID: 9; Created On: 20/09/2022 13:14:57; Component Type: Testpoint; Last Updated: 20/09/2022 13:15:39; Manufacturer: NULL; Supplier 1: NULL; Supplier Part Number 1: NULL; Type: Testpoint; Live Cycle Status: 1

## Sheet Power_Supply_Input.SchDoc
size A4; Author: AG / EA / MG; CompanyName: Technische Hochschule Nürnberg Georg Simon Ohm; Organization: UltraZohm; Address1: Kesslerplatz 12; Address2: 90489 Nürnberg; Address3: GERMANY; SheetNumber: 23; Website: www.ultrazohm.com
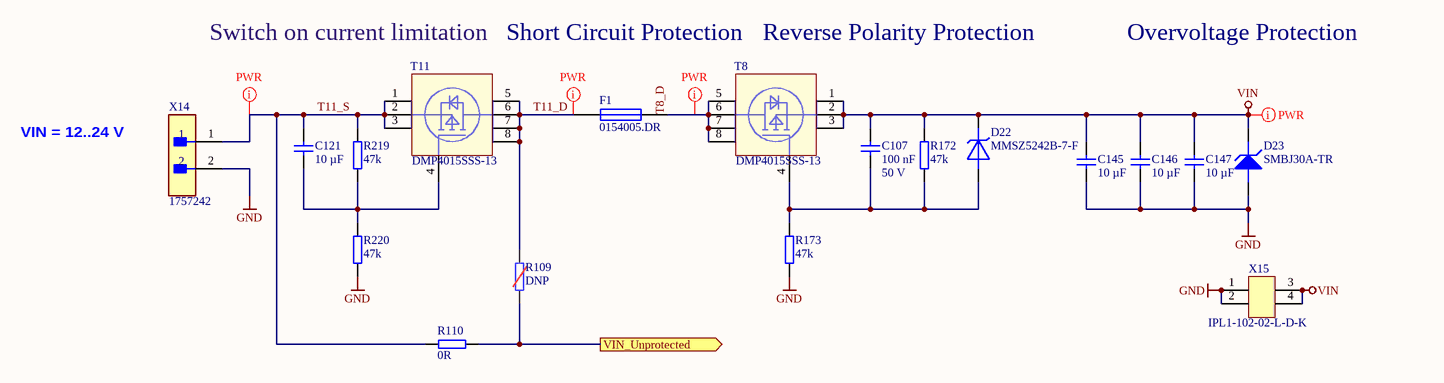
[diagram p26: Power_Supply_Input.SchDoc]

### Parts
C107  100 nF  Voltage: 50 V  [C_0603_TE]
C121  10 µF  [C_1206_TE]
C145  10 µF  [C_1206_TE]
C146  10 µF  [C_1206_TE]
C147  10 µF  [C_1206_TE]
D22  MMSZ5242B-7-F  [DIOM5226X240N]
D23  SMBJ30A-TR  [DIOM5436X244N]
F1  0154005.DR  [Littlefuse_154]
R109  DNP  [R_1206_TE-DNP]  (no BOM)
R110  0R  [R_1206_TE]
R172  47k  [R_0603_TE]
R173  47k  [R_0603_TE]
R219  47k  [R_0603_TE]
R220  47k  [R_0603_TE]
T8  DMP4015SSS-13  [SOIC127P600X175-8N]
T11  DMP4015SSS-13  [SOIC127P600X175-8N]
X14  1757242  [1757242]
X15  IPL1-102-02-L-D-K  [IPL1-102-02-L-D-K]

### Ports
VIN_Unprotected (out)

### Nets
GND: C145.1 C146.1 C147.1 D23.2(ANODE) R173.1 R220.1 X14.2 X15.1 X15.2
VIN: C107.1 C145.2 C146.2 C147.2 D22.2(K) D23.1(KATHODE) R172.2 T8.1(SOURCE) T8.2(SOURCE) T8.3(SOURCE) X15.3 X15.4
T8_D: F1.2 T8.5(DRAIN) T8.6(DRAIN) T8.7(DRAIN) T8.8(DRAIN)
T11_D: F1.1 R109.2 T11.5(DRAIN) T11.6(DRAIN) T11.7(DRAIN) T11.8(DRAIN)
T11_S: C121.1 R110.1 R219.2 T11.1(SOURCE) T11.2(SOURCE) T11.3(SOURCE) X14.1
VIN2: R109.1 R110.2 ; port VIN_Unprotected
NetC107_2: C107.2 D22.1(A) R172.1 R173.2 T8.4(GATE)
NetC121_2: C121.2 R219.1 R220.2 T11.4(GATE)

### Layout directives
net class PWR: T8_D, T11_D, T11_S, VIN

### Notes on the sheet
- Switch on current limitation
- Short Circuit Protection
- Reverse Polarity Protection
- Overvoltage Protection
- VIN = 12..24 V
- Title
- Revision:
- Design Engineer:
- Date:
- Project:
- Sheet
- of

### Library data of the parts
C107 = UZgen_C_0603_100nF_50V_X7R: as C88 on sheet Power_Supply_TPS54260; Value: 100 nF; Technology: X7R; Manufacturer Part Number: UZgen_C_0603_100nF_50V_X7R; PartID: 1; Created On: 02/07/2024 14:42:23; Device Package: 0603; Mounting Type: SMD; Last Updated: 02/08/2024 14:45:57
C121 C145-C147 = UZgen_C_1206_10uF_50V_X7R: as C41-C44 on sheet Power_Supply_1; Value: 10 µF; Manufacturer Part Number: UZgen_C_1206_10uF_50V_X7R; PartID: 5807; Created On: 20/03/2025 14:05:00; Device Package: 1206; Last Updated: 20/03/2025 14:05:00; Mounting Type: SMD; Technology: X7R
D22 = MMSZ5242B-7-F: Zener Diode, 12V, 500 mW; Manufacturer: Diodes Incorporated; Power: 0.5W; Power Loss: 500mW; Zener Impedance: 30 Ohm; Created from: MGremer; Category: zener; Manufacturer Part Number: MMSZ5242B-7-F; Package: SOD-123; Supplier: Mouser; Supplier Part Number 1: 621-MMSZ5242B-F; Mounting Style: SMT; Pins: 2; Voltage: 12V; PartID: 3; Created On: 06/01/2021 09:28:59; ComponentLink1Description: Datasheet; ComponentLink1URL: https://www.mouser.de/datasheet/2/115/DIOD_S_A0003550771_1-2542306.pdf; Component Type: Zener Diode; Device Package: SOD-123-2; Last Updated: 11/07/2024 09:34:11; Mounting Type: SMD; Operating Temperature: -65 - 150 °C; Series: MMSZ524; Supplier 1: Mouser; Type: Zener Diode; Value: 12V; Live Cycle Status: 1; Stock number: not stored; LCSC Part Number: C500776
D23 = SMBJ30A-TR: TVS Diode 30V 600W SMB unidirectional / ESD suppressor; Manufacturer: STMicroelectronics; Type: TVS-Diode; Created from: PBaumann; Manufacturer Part Number: SMBJ30A-TR; PartID: 19; Created On: 05/03/2021 11:12:07; ComponentLink1Description: Datasheet; ComponentLink1URL: https://www.st.com/resource/en/datasheet/smbj30a.pdf; Component Type: TVS Diode; Device Package: DO-214AA-2; Last Updated: 23/07/2025 19:13:45; Mounting Type: SMD; Operating Temperature: -55 - 150°C; Series: SMBJxxA; Supplier 1: LCSC; Supplier Part Number 1: C133663; Value: 30V; Live Cycle Status: 1; LCSC Part Number: C133663
F1 = 0154005.DR: Fuse OMNI BLOK 154; Manufacturer: Littlefuse; Nominal current: 5 A; Nominal voltage AC: 125 VAC; Nominal voltage DC: 125 VDC; Resistance: 12.5 mOhm; Value: 5 A; Created from: MGremer; Manufacturer Part Number: 0154005.DR; PartID: 1; Created On: 07/01/2021 10:17:19; ComponentLink1Description: Datasheet; ComponentLink1URL: https://www.mouser.de/datasheet/2/240/Littelfuse_Fuse_154_154T_154L_154TL_Datasheet_pdf-365375.pdf; Component Type: NAN02 - 154 OMNI-BLOK; Device Package: OMNI-BLOK; Last Updated: 04/09/2024 15:44:00; Mounting Type: SMD; Operating Temperature: -55 - 125 °C; Series: 154; Supplier 1: Mouser; Supplier Part Number 1: 576-0154005.DR; Type: Fuse; Live Cycle Status: 1; Supplier 2: LCSC; Supplier Part Number 2: C206916; LCSC Part Number: C206916
R109 = UZgen_R_1206_DNP: as R139Y on sheet Power_Supply_2; Manufacturer Part Number: UZgen_R_1206_DNP; PartID: 595; Created On: 25/03/2025 14:26:15; Value: DNP; Device Package: 1206; Tolerance: -; Mounting Type: SMD; Last Updated: 02/04/2025 19:05:00
R110 = UZgen_R_1206_0R: as R221-R224 on sheet Power_Supply_1; Manufacturer Part Number: UZgen_R_1206_0R; PartID: 583; Created On: 08/07/2024 14:34:30; Value: 0R; Device Package: 1206; Mounting Type: SMD; Last Updated: 08/07/2024 14:34:30
R172 R173 R219 R220 = UZgen_R_0603_47k: Generic resistor; Manufacturer: UZgen; Tolerance: 1 %; Created from: UZgenTool; Value: 47k; Manufacturer Part Number: UZgen_R_0603_47k; PartID: 260; Created On: 02.07.2024 17:29:50; Device Package: 0603; Mounting Type: SMD; Last Updated: 02.07.2024 17:29:50
T8 T11 = DMP4015SSS-13: MOSFET MOSFET BVDSS: 41V-60 1V-60V SO-8 T&R 2.5K; Manufacturer: Diodes Incorporated; Type: P-Channel Power MOSFET; Number Of Channels: 1; Drain Source Voltage: 40 V; Drain DC Current: 10.1 A; RDS On Resistance: 11 mOhm; Power Dissipation: 1.82 W; Value: 40 V; Created from: FRosner; Manufacturer Part Number: DMP4015SSS-13; PartID: 2; Created On: 28.06.2024 09:26:52; ComponentLink1Description: Datasheet; ComponentLink1URL: https://www.diodes.com/assets/Datasheets/DMP4015SSS.pdf; Component Type: MOSFET SO-8; Device Package: SOIC-8; Last Updated: 09.07.2024 20:11:46; Mounting Type: SMD; Operating Temperature: -55 - 150 °C; Series: DMP40; Supplier 1: Mouser; Supplier Part Number 1: 621-DMP4015SSS-13; Supplier 2: LCSC; Supplier Part Number 2: C508210; Live Cycle Status: 1; LCSC Part Number: C508210
X14 = 1757242: Pluggable Terminal Blocks 2 Pos 5.08mm pitch Through Hole Header; Manufacturer: Phoenix Contact; Created from: FRosner; Number of positions: 2; Manufacturer Part Number: 1757242; PartID: 58; Created On: 20/04/2023 12:39:10; ComponentLink1Description: Datasheet; ComponentLink1URL: https://wmsc.lcsc.com/wmsc/upload/file/pdf/v2/lcsc/1811051310_Phoenix-Contact-1757242_C90074.pdf; Component Type: Phoenix Connector; Device Package: Connector; Last Updated: 04/07/2024 08:41:38; Mounting Type: THT; Operating Temperature: -40 - 100  °C; Supplier 1: Mouser; Supplier Part Number 1: 651-1757242; Supplier 2: LCSC; Supplier Part Number 2: C90074; Type: Connector; Live Cycle Status: 1; Number of rows: 1; LCSC Part Number: C90074; Stock number: not stored
X15 = 30759: AN: 30759; Mixed: SMT; H-ART: IPL1-102-02-L-D-K-TR; Temperature-Range: -55/+125; Extra: Connector Header IPL1, 2-row 4pos, key polarization, SMT 0°; Case: IPL1; HelpURL: b:\AD\adlib\datasheet\Samtec\IPL1-SMT\

## Sheet Block_Diagram.SchDoc
size A4; PageSetup: Record=PageOptions|CenterHorizontal=True|CenterVertical=True|PrintScale=0.92|XCorrection=1.00|YCorrection=1.00|PrintKind=0|BorderSize=5000000|LeftOffset=0|BottomOffset=0|Orientation=2|PaperLength=1000|PaperWidth=1000|Scale=100|PaperSource=7|PrintQuality=-4|MediaType=1|DitherType=10|PrintScaleMode=1|PaperKind=A4; Author: AG / EA / MG; CompanyName: Technische Hochschule Nürnberg Georg Simon Ohm; Organization: UltraZohm; Address1: Kesslerplatz 12; Address2: 90489 Nürnberg; Address3: GERMANY; SheetNumber: 41; Website: www.ultrazohm.com
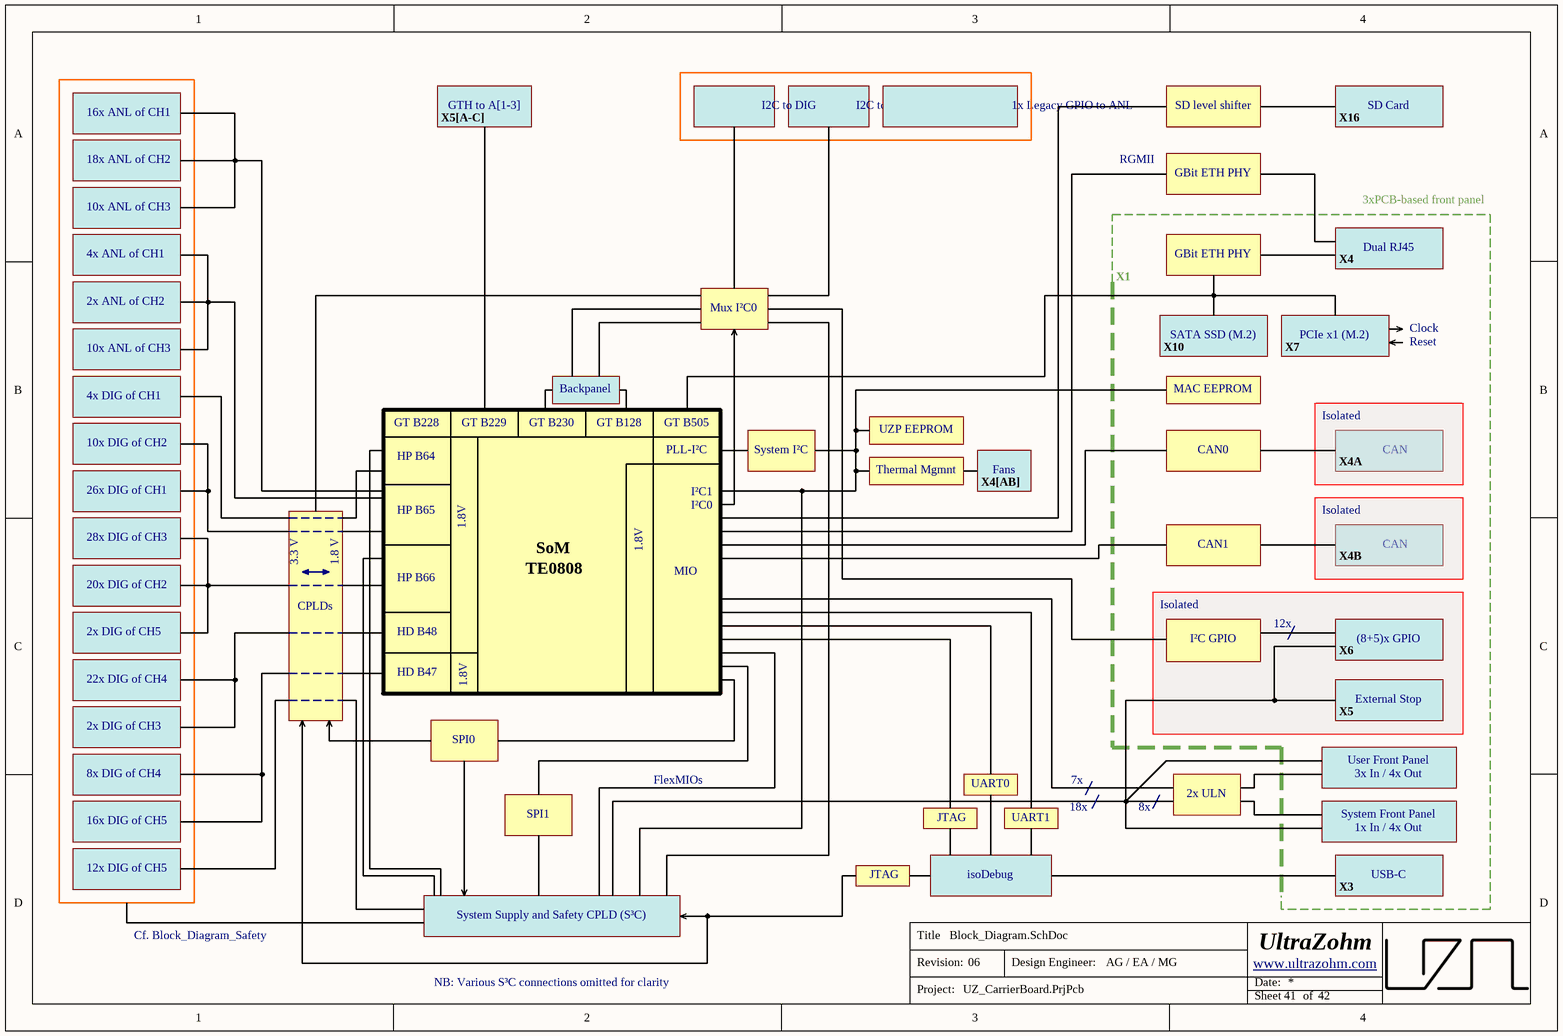
[diagram p27: Block_Diagram.SchDoc]

### Notes on the sheet
- 16x ANL of CH1
- GTH to A[1-3]
- I2C to DIG
- I2C to ANL
- 1x Legacy GPIO to ANL
- SD level shifter
- SD Card
- 18x ANL of CH2
- X5[A-C]
- RGMII
- GBit ETH PHY
- X16
- 10x ANL of CH3
- 3xPCB-based front panel
- Dual RJ45
- 4x ANL of CH1
- 2x ANL of CH2
- Mux I²C0
- X1
- X4
- X10
- SATA SSD (M.2)
- X7
- PCIe x1 (M.2)
- Clock
- Reset
- 4x DIG of CH1
- 10x DIG of CH2
- GT B228
- GT B229
- GT B230
- Backpanel
- GT B128
- GT B505
- UZP EEPROM
- MAC EEPROM
- Isolated
- 26x DIG of CH1
- HP B64
- HP B65
- PLL-I²C
- I²C1
- I²C0
- System I²C
- Thermal Mgmnt
- X4[AB]
- Fans
- CAN0
- X4A
- CAN
- 28x DIG of CH3
- 3.3 V
- 1.8 V
- HP B66
- 1.8V
- TE0808
- SoM
- MIO
- CAN1
- X4B
- 20x DIG of CH2
- 2x DIG of CH5
- CPLDs
- HD B48
- I²C GPIO
- 12x
- X6
- (8+5)x GPIO
- 22x DIG of CH4
- HD B47
- X5
- External Stop
- 8x DIG of CH4
- 2x DIG of CH3
- SPI0
- FlexMIOs
- UART0
- 7x
- User Front Panel
- 3x In / 4x Out
- 16x DIG of CH5
- SPI1
- JTAG
- UART1
- 18x
- 8x
- 2x ULN
- System Front Panel
- 1x In / 4x Out
- 12x DIG of CH5
- System Supply and Safety CPLD (S³C)
- isoDebug
- X3
- USB-C
- Cf. Block_Diagram_Safety
- NB: Various S³C connections omitted for clarity
- Title
- Revision:
- Design Engineer:
- Date:
- Project:
- Sheet
- of

## Sheet S3C.SchDoc
size A4; Organization: UltraZohm; SheetNumber: 8
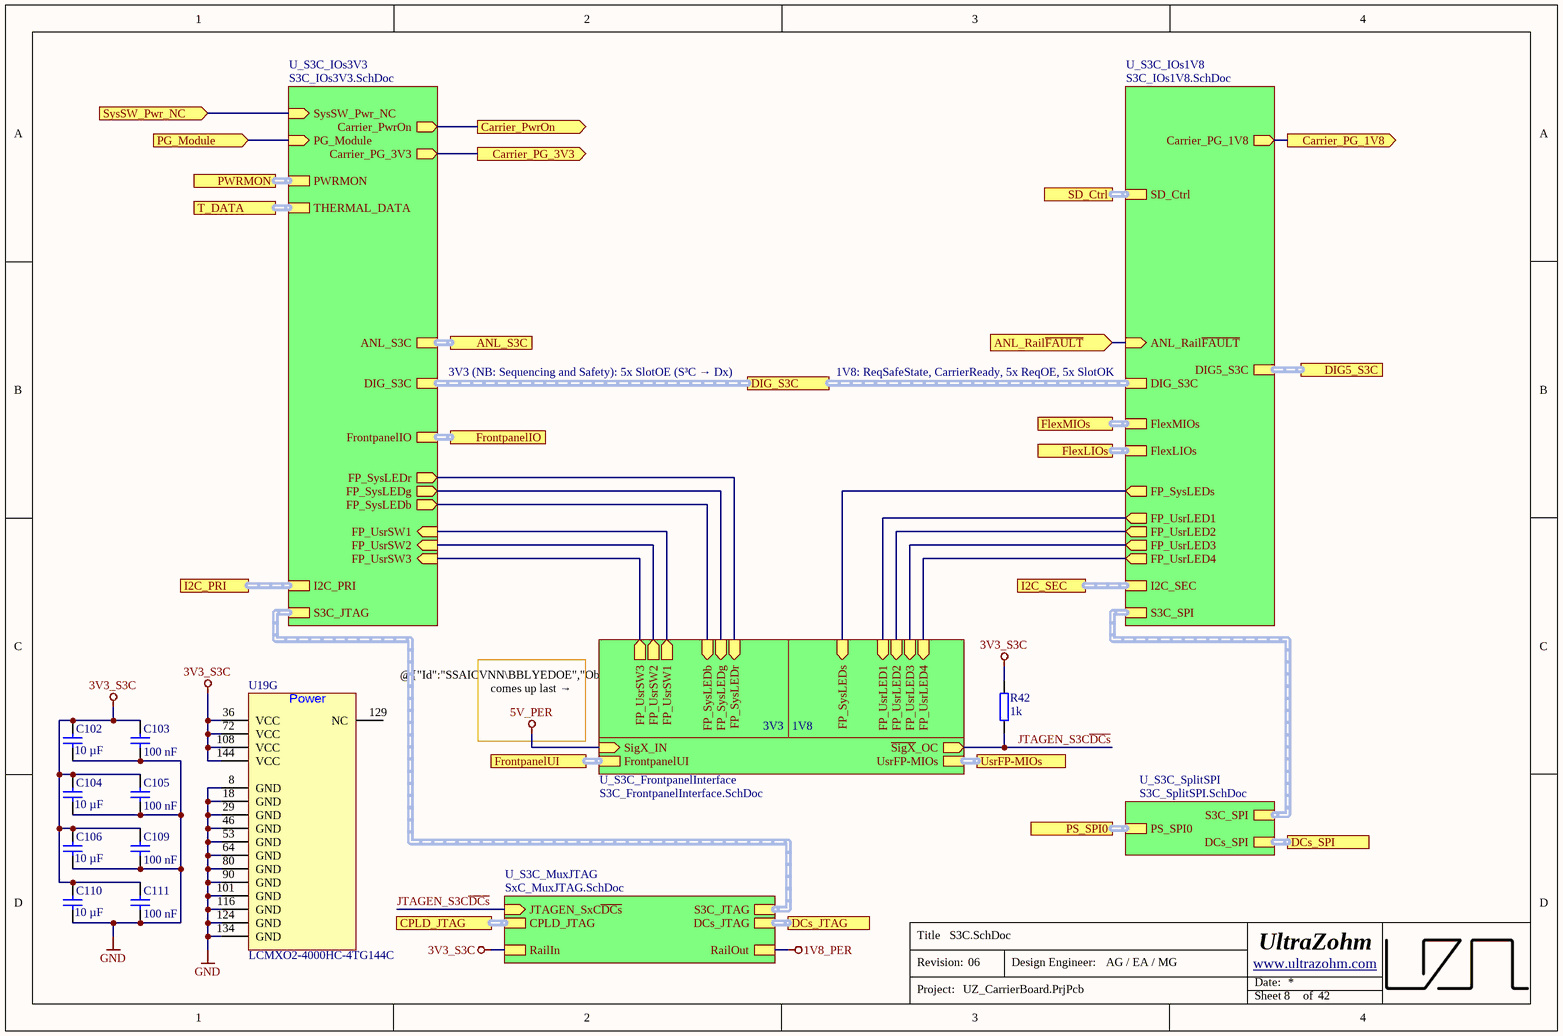
[diagram p28: S3C.SchDoc]

### Parts
C102  10 µF  [C_0603_TE]
C103  100 nF  [C_0603_TE]
C104  10 µF  [C_0603_TE]
C105  100 nF  [C_0603_TE]
C106  10 µF  [C_0603_TE]
C109  100 nF  [C_0603_TE]
C110  10 µF  [C_0603_TE]
C111  100 nF  [C_0603_TE]
R42  1k  [R_0603_TE]
U19  LCMXO2-4000HC-4TG144C  [QFP50P2200X2200X160-144N]  (part G of 7)

### Sub-sheets
U_S3C_FrontpanelInterface = S3C_FrontpanelInterface.SchDoc: SigX_IN (in), ~{SigX}_OC (out), FP_UsrLED1 (in), FP_UsrLED2 (in), FP_UsrLED3 (in), FP_UsrLED4 (in), FP_UsrSW1 (out), FP_UsrSW2 (out), FP_UsrSW3 (out), FP_SysLEDb (in), FP_SysLEDr (in), FP_SysLEDg (in), FP_SysLEDs (in), FrontpanelUI (harness FrontpanelUI), UsrFP-MIOs (harness UsrFP-MIOs)
U_S3C_IOs1V8 = S3C_IOs1V8.SchDoc: S3C_SPI (harness SPI_S3C), FlexMIOs (harness FlexMIOs), DIG5_S3C (harness DIG5_S3C), SD_Ctrl (harness SD_Ctrl), I2C_SEC (harness I2C), FP_UsrLED1 (out), FP_UsrLED2 (out), FP_UsrLED3 (out), FP_UsrLED4 (out), FP_SysLEDs (out), Carrier_PG_1V8 (out), DIG_S3C (harness DIG_S3C), FlexLIOs (harness FlexLIOs), ANL_Rail~{FAULT} (in)
U_S3C_IOs3V3 = S3C_IOs3V3.SchDoc: S3C_JTAG (harness JTAG_S3C), I2C_PRI (harness I2C), SysSW_Pwr_NC (in), THERMAL_DATA (harness T_DATA), FrontpanelIO (harness FrontpanelIO), PWRMON (harness S3C_PWRMON), ANL_S3C (harness ANL_S3C), Carrier_PwrOn (out), PG_Module (in), FP_UsrSW3 (in), FP_UsrSW2 (in), FP_UsrSW1 (in), FP_SysLEDr (out), FP_SysLEDg (out), FP_SysLEDb (out), Carrier_PG_3V3 (out), DIG_S3C (harness DIG_S3C)
U_S3C_MuxJTAG = SxC_MuxJTAG.SchDoc (file not in this document): CPLD_JTAG (harness JTAG), JTAGEN_SxC~{DCs} (in), S3C_JTAG (harness JTAG_S3C), DCs_JTAG (harness JTAG), RailIn, RailOut  | SubSheet_SheetNumber: 11
U_S3C_SplitSPI = S3C_SplitSPI.SchDoc: DCs_SPI (harness SPI_CPLDs), S3C_SPI (harness SPI_S3C), PS_SPI0 (harness SPI)

### Ports
ANL_Rail~{FAULT} (in), ANL_S3C (harness ANL_S3C), Carrier_PG_1V8 (out), Carrier_PG_3V3 (out), Carrier_PwrOn (out), CPLD_JTAG (harness JTAG), DCs_JTAG (harness JTAG), DCs_SPI (harness SPI_CPLDs), DIG5_S3C (harness DIG5_S3C), DIG_S3C (harness DIG_S3C), FlexLIOs (harness FlexLIOs), FlexMIOs (harness FlexMIOs), FrontpanelIO (harness FrontpanelIO), FrontpanelUI (harness FrontpanelUI), I2C_PRI (harness I2C), I2C_SEC (harness I2C), PG_Module (in), PS_SPI0 (harness SPI), PWRMON (harness S3C_PWRMON), SD_Ctrl (harness SD_Ctrl), SysSW_Pwr_NC (in), T_DATA (harness T_DATA), UsrFP-MIOs (harness UsrFP-MIOs)

### Nets
3V3_S3C: C102.1 C103.2 C104.1 C105.2 C106.1 C109.2 C110.1 C111.2 R42.2 U19.36(VCC) U19.72(VCC) U19.108(VCC) U19.144(VCC) ; sheet U_S3C_MuxJTAG/RailIn
GND: C102.2 C103.1 C104.2 C105.1 C106.2 C109.1 C110.2 C111.1 U19.8(GND) U19.18(GND) U19.29(GND) U19.46(GND) U19.53(GND) U19.64(GND) U19.80(GND) U19.90(GND) U19.101(GND) U19.116(GND) U19.124(GND) U19.134(GND)
ANL_Rail~{FAULT}: port ANL_Rail~{FAULT}, sheet U_S3C_IOs1V8/ANL_Rail~{FAULT}
Carrier_PG_1V8: port Carrier_PG_1V8, sheet U_S3C_IOs1V8/Carrier_PG_1V8
Carrier_PG_3V3: port Carrier_PG_3V3, sheet U_S3C_IOs3V3/Carrier_PG_3V3
Carrier_PwrOn: port Carrier_PwrOn, sheet U_S3C_IOs3V3/Carrier_PwrOn
FP_SysLEDb: sheet U_S3C_IOs3V3/FP_SysLEDb, sheet U_S3C_FrontpanelInterface/FP_SysLEDb
FP_SysLEDg: sheet U_S3C_IOs3V3/FP_SysLEDg, sheet U_S3C_FrontpanelInterface/FP_SysLEDg
FP_SysLEDr: sheet U_S3C_IOs3V3/FP_SysLEDr, sheet U_S3C_FrontpanelInterface/FP_SysLEDr
FP_SysLEDs: sheet U_S3C_IOs1V8/FP_SysLEDs, sheet U_S3C_FrontpanelInterface/FP_SysLEDs
FP_UsrLED1: sheet U_S3C_IOs1V8/FP_UsrLED1, sheet U_S3C_FrontpanelInterface/FP_UsrLED1
FP_UsrLED2: sheet U_S3C_IOs1V8/FP_UsrLED2, sheet U_S3C_FrontpanelInterface/FP_UsrLED2
FP_UsrLED3: sheet U_S3C_IOs1V8/FP_UsrLED3, sheet U_S3C_FrontpanelInterface/FP_UsrLED3
FP_UsrLED4: sheet U_S3C_IOs1V8/FP_UsrLED4, sheet U_S3C_FrontpanelInterface/FP_UsrLED4
FP_UsrSW1: sheet U_S3C_IOs3V3/FP_UsrSW1, sheet U_S3C_FrontpanelInterface/FP_UsrSW1
FP_UsrSW2: sheet U_S3C_IOs3V3/FP_UsrSW2, sheet U_S3C_FrontpanelInterface/FP_UsrSW2
FP_UsrSW3: sheet U_S3C_IOs3V3/FP_UsrSW3, sheet U_S3C_FrontpanelInterface/FP_UsrSW3
JTAGEN_S3C~{DCs}: R42.1 ; sheet U_S3C_MuxJTAG/JTAGEN_SxC~{DCs}, sheet U_S3C_FrontpanelInterface/~{SigX}_OC
PG_Module: port PG_Module, sheet U_S3C_IOs3V3/PG_Module
SysSW_Pwr_NC: port SysSW_Pwr_NC, sheet U_S3C_IOs3V3/SysSW_Pwr_NC

Not connected (* = marked no-connect by the designer): U19 129(NC)

### Buses and harness runs
harness port ANL_S3C = sheet U_S3C_IOs3V3/ANL_S3C
harness port CPLD_JTAG = sheet U_S3C_MuxJTAG/CPLD_JTAG
harness port DCs_JTAG = sheet U_S3C_MuxJTAG/DCs_JTAG
harness port DCs_SPI = sheet U_S3C_SplitSPI/DCs_SPI
harness port DIG5_S3C = sheet U_S3C_IOs1V8/DIG5_S3C
harness port DIG_S3C = sheet U_S3C_IOs1V8/DIG_S3C = sheet U_S3C_IOs3V3/DIG_S3C
harness port FlexLIOs = sheet U_S3C_IOs1V8/FlexLIOs
harness port FlexMIOs = sheet U_S3C_IOs1V8/FlexMIOs
harness port FrontpanelIO = sheet U_S3C_IOs3V3/FrontpanelIO
harness port FrontpanelUI = sheet U_S3C_FrontpanelInterface/FrontpanelUI
harness port I2C_PRI = sheet U_S3C_IOs3V3/I2C_PRI
harness port I2C_SEC = sheet U_S3C_IOs1V8/I2C_SEC
harness port PS_SPI0 = sheet U_S3C_SplitSPI/PS_SPI0
harness port PWRMON = sheet U_S3C_IOs3V3/PWRMON
harness port SD_Ctrl = sheet U_S3C_IOs1V8/SD_Ctrl
harness port T_DATA = sheet U_S3C_IOs3V3/THERMAL_DATA
harness port UsrFP-MIOs = sheet U_S3C_FrontpanelInterface/UsrFP-MIOs
harness sheet U_S3C_IOs1V8/S3C_SPI = sheet U_S3C_SplitSPI/S3C_SPI
harness sheet U_S3C_IOs3V3/S3C_JTAG = sheet U_S3C_MuxJTAG/S3C_JTAG

### Notes on the sheet
- 3V3 (NB: Sequencing and Safety): 5x SlotOE (S³C → Dx)
- 1V8: ReqSafeState, CarrierReady, 5x ReqOE, 5x SlotOK
- @{"Id":"SSAICVNN\BBLYEDOE","ObjectType":1} comes up last → switch JTAG
- 3V3
- 1V8
- Title
- Revision:
- Design Engineer:
- Date:
- Project:
- Sheet
- of
- (in symbol LCMXO2-4000HC-4TG144C, part G) Power

### Library data of the parts
C102 C104 C106 C110 = UZgen_C_0603_10uF_6.3V_X7R: Generic capacitor; Manufacturer: UZgen; Voltage: 6.3V; Tolerance: 10 %; Created from: UZgenTool; Manufacturer Part Number: UZgen_C_0603_10uF_6.3V_X7R; PartID: 3631; Created On: 02.08.2024 11:17:55; Value: 10 µF; Device Package: 0603; Technology: X7R; Mounting Type: SMD; Last Updated: 02.08.2024 11:17:55
C103 C105 C109 C111 = UZgen_C_0603_100nF_50V_X7R: Generic capacitor; Manufacturer: UZgen; Tolerance: 10 %; Voltage: 50 V; Created from: AGeiger; Value: 100 nF; Technology: X7R; Manufacturer Part Number: UZgen_C_0603_100nF_50V_X7R; PartID: 1; Created On: 02/07/2024 14:42:23; Device Package: 0603; Mounting Type: SMD; Last Updated: 02/08/2024 14:45:57
R42 = UZgen_R_0603_1k: as R92 on sheet Power_Supply_1; Manufacturer Part Number: UZgen_R_0603_1k; PartID: 221; Created On: 02/07/2024 17:29:49; Value: 1k; Device Package: 0603; Mounting Type: SMD; Last Updated: 02/07/2024 17:29:49
U19 = LCMXO2-4000HC-4TG144C: TQFP-144(20x20) Programmable Logic Device (CPLDs/FPGAs) ROHS; Manufacturer: Lattice; Created from: FRosner; Manufacturer Part Number: LCMXO2-4000HC-4TG144C; PartID: 38; Created On: 03/07/2024 17:33:36; ComponentLink1Description: Datasheet; ComponentLink1URL: https://wmsc.lcsc.com/wmsc/upload/file/pdf/v2/lcsc/2403111456_Lattice-LCMXO2-4000HC-4TG144C_C1521625.pdf; Component Type: CPLD; Device Package: TQFP-144; Last Updated: 23/08/2024 11:42:29; Mounting Type: SMD; Operating Temperature: -0 to +85 °C; Supplier 1: LCSC; Supplier Part Number 1: C1521625; Supplier 2: Mouser; Supplier Part Number 2: 842-XO24000HC4TG144C; Type: CPLD; Live Cycle Status: 1; LCSC Part Number: C1521625; Stock number: not stored